# EAGLE schematic M847 (EAGLE 6.6.0)

## Sheet 1 of 3
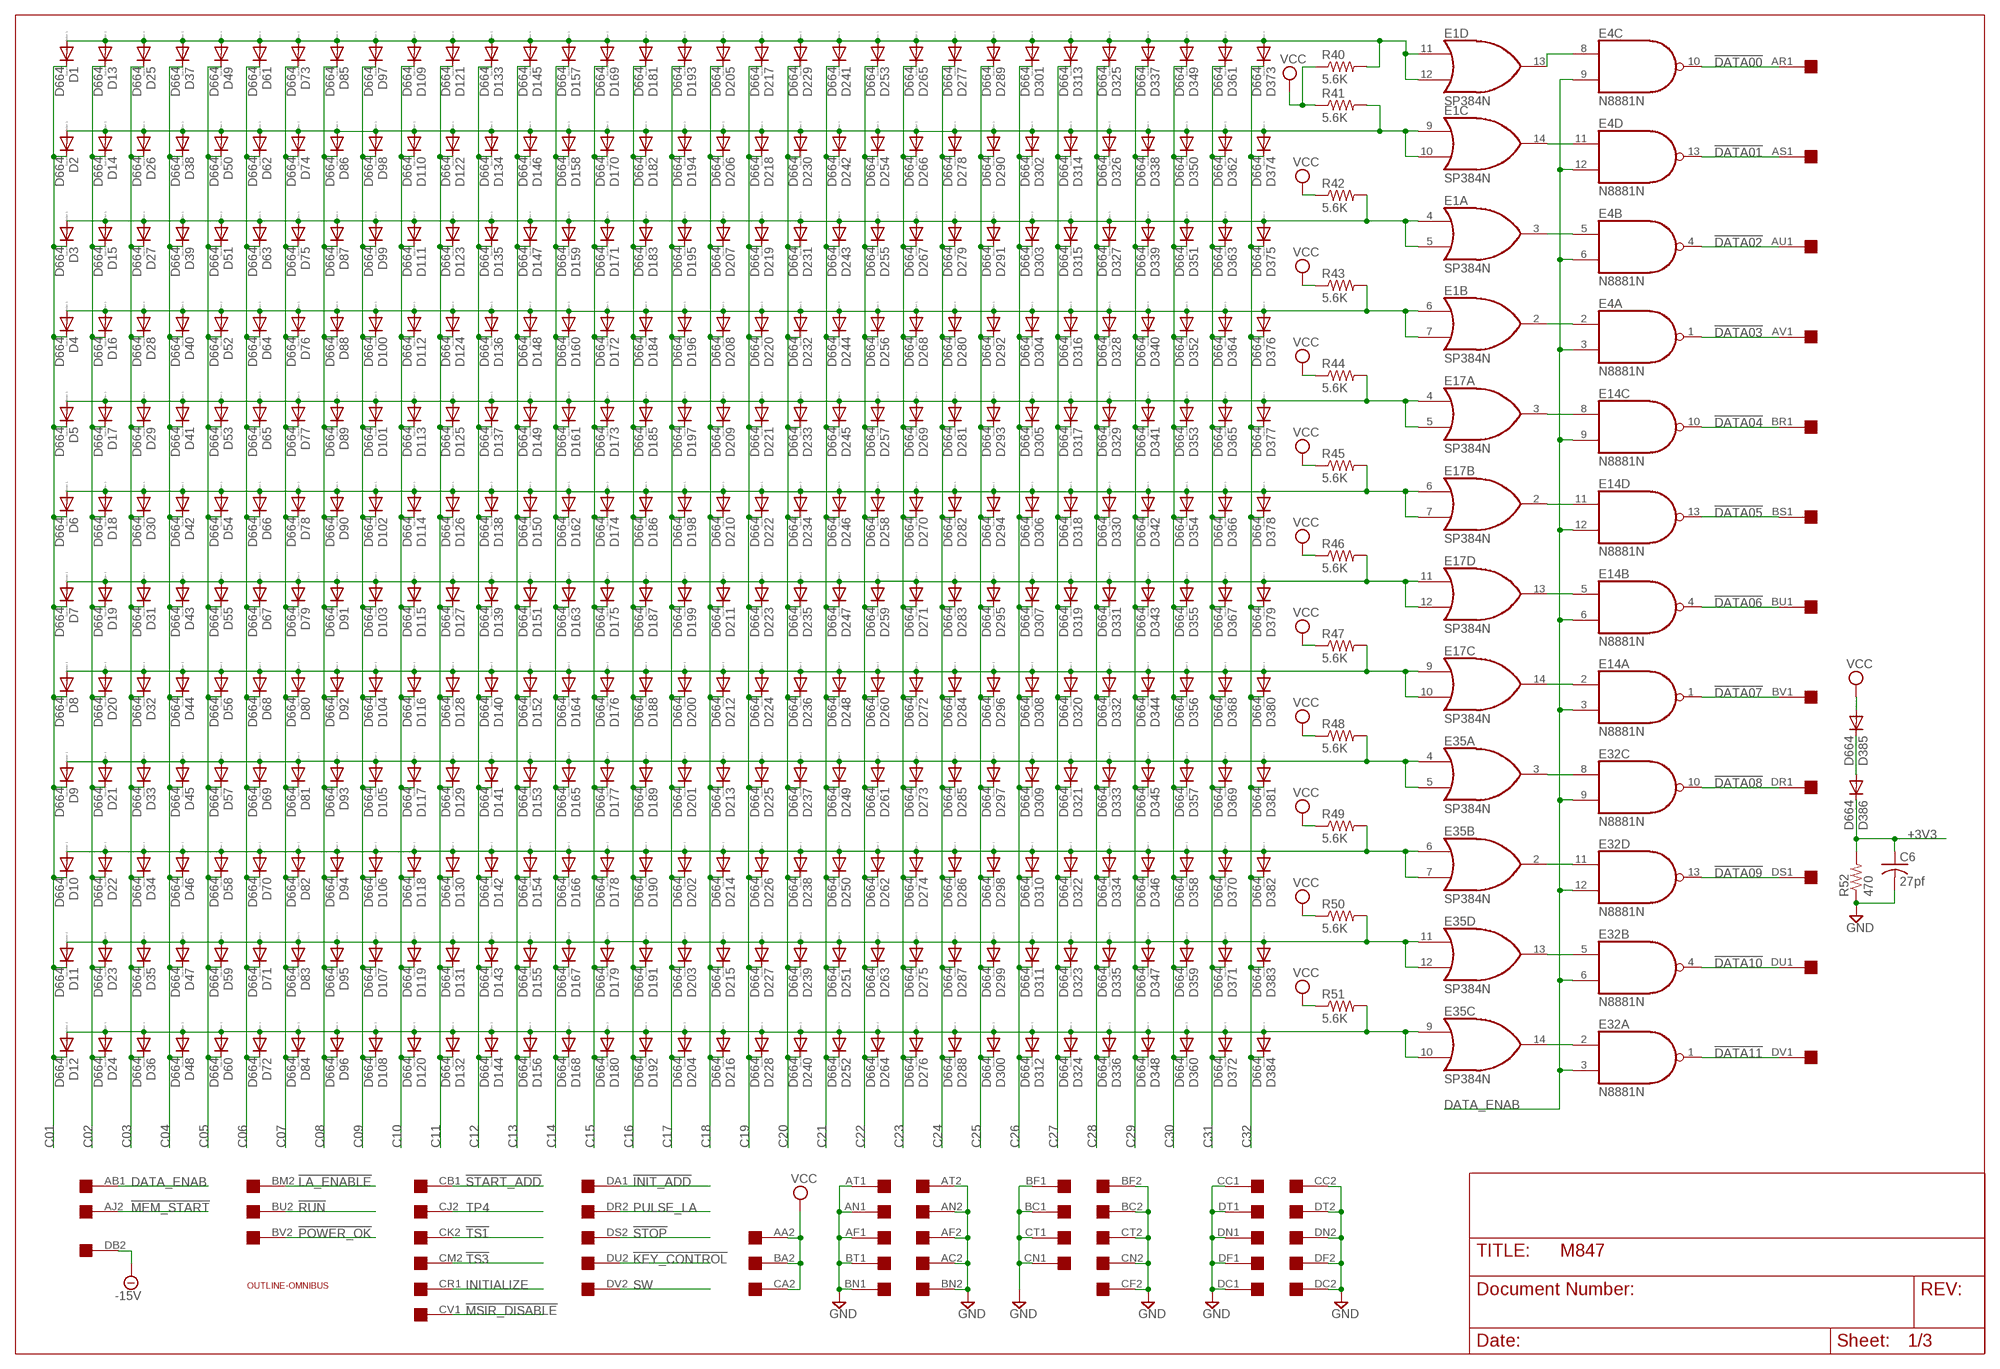
[diagram p0: schematic, sheet 1]

### Parts
C6  27pf  C-US050-025X075  [C050-025X075]
D1  D664  1N4148DO35-10  [DO35-10]
D2  D664  1N4148DO35-10  [DO35-10]
D3  D664  1N4148DO35-10  [DO35-10]
D4  D664  1N4148DO35-10  [DO35-10]
D5  D664  1N4148DO35-10  [DO35-10]
D6  D664  1N4148DO35-10  [DO35-10]
D7  D664  1N4148DO35-10  [DO35-10]
D8  D664  1N4148DO35-10  [DO35-10]
D9  D664  1N4148DO35-10  [DO35-10]
D10  D664  1N4148DO35-10  [DO35-10]
D11  D664  1N4148DO35-10  [DO35-10]
D12  D664  1N4148DO35-10  [DO35-10]
D13  D664  1N4148DO35-10  [DO35-10]
D14  D664  1N4148DO35-10  [DO35-10]
D15  D664  1N4148DO35-10  [DO35-10]
D16  D664  1N4148DO35-10  [DO35-10]
D17  D664  1N4148DO35-10  [DO35-10]
D18  D664  1N4148DO35-10  [DO35-10]
D19  D664  1N4148DO35-10  [DO35-10]
D20  D664  1N4148DO35-10  [DO35-10]
D21  D664  1N4148DO35-10  [DO35-10]
D22  D664  1N4148DO35-10  [DO35-10]
D23  D664  1N4148DO35-10  [DO35-10]
D24  D664  1N4148DO35-10  [DO35-10]
D25  D664  1N4148DO35-10  [DO35-10]
D26  D664  1N4148DO35-10  [DO35-10]
D27  D664  1N4148DO35-10  [DO35-10]
D28  D664  1N4148DO35-10  [DO35-10]
D29  D664  1N4148DO35-10  [DO35-10]
D30  D664  1N4148DO35-10  [DO35-10]
D31  D664  1N4148DO35-10  [DO35-10]
D32  D664  1N4148DO35-10  [DO35-10]
D33  D664  1N4148DO35-10  [DO35-10]
D34  D664  1N4148DO35-10  [DO35-10]
D35  D664  1N4148DO35-10  [DO35-10]
D36  D664  1N4148DO35-10  [DO35-10]
D37  D664  1N4148DO35-10  [DO35-10]
D38  D664  1N4148DO35-10  [DO35-10]
D39  D664  1N4148DO35-10  [DO35-10]
D40  D664  1N4148DO35-10  [DO35-10]
D41  D664  1N4148DO35-10  [DO35-10]
D42  D664  1N4148DO35-10  [DO35-10]
D43  D664  1N4148DO35-10  [DO35-10]
D44  D664  1N4148DO35-10  [DO35-10]
D45  D664  1N4148DO35-10  [DO35-10]
D46  D664  1N4148DO35-10  [DO35-10]
D47  D664  1N4148DO35-10  [DO35-10]
D48  D664  1N4148DO35-10  [DO35-10]
D49  D664  1N4148DO35-10  [DO35-10]
D50  D664  1N4148DO35-10  [DO35-10]
D51  D664  1N4148DO35-10  [DO35-10]
D52  D664  1N4148DO35-10  [DO35-10]
D53  D664  1N4148DO35-10  [DO35-10]
D54  D664  1N4148DO35-10  [DO35-10]
D55  D664  1N4148DO35-10  [DO35-10]
D56  D664  1N4148DO35-10  [DO35-10]
D57  D664  1N4148DO35-10  [DO35-10]
D58  D664  1N4148DO35-10  [DO35-10]
D59  D664  1N4148DO35-10  [DO35-10]
D60  D664  1N4148DO35-10  [DO35-10]
D61  D664  1N4148DO35-10  [DO35-10]
D62  D664  1N4148DO35-10  [DO35-10]
D63  D664  1N4148DO35-10  [DO35-10]
D64  D664  1N4148DO35-10  [DO35-10]
D65  D664  1N4148DO35-10  [DO35-10]
D66  D664  1N4148DO35-10  [DO35-10]
D67  D664  1N4148DO35-10  [DO35-10]
D68  D664  1N4148DO35-10  [DO35-10]
D69  D664  1N4148DO35-10  [DO35-10]
D70  D664  1N4148DO35-10  [DO35-10]
D71  D664  1N4148DO35-10  [DO35-10]
D72  D664  1N4148DO35-10  [DO35-10]
D73  D664  1N4148DO35-10  [DO35-10]
D74  D664  1N4148DO35-10  [DO35-10]
D75  D664  1N4148DO35-10  [DO35-10]
D76  D664  1N4148DO35-10  [DO35-10]
D77  D664  1N4148DO35-10  [DO35-10]
D78  D664  1N4148DO35-10  [DO35-10]
D79  D664  1N4148DO35-10  [DO35-10]
D80  D664  1N4148DO35-10  [DO35-10]
D81  D664  1N4148DO35-10  [DO35-10]
D82  D664  1N4148DO35-10  [DO35-10]
D83  D664  1N4148DO35-10  [DO35-10]
D84  D664  1N4148DO35-10  [DO35-10]
D85  D664  1N4148DO35-10  [DO35-10]
D86  D664  1N4148DO35-10  [DO35-10]
D87  D664  1N4148DO35-10  [DO35-10]
D88  D664  1N4148DO35-10  [DO35-10]
D89  D664  1N4148DO35-10  [DO35-10]
D90  D664  1N4148DO35-10  [DO35-10]
D91  D664  1N4148DO35-10  [DO35-10]
D92  D664  1N4148DO35-10  [DO35-10]
D93  D664  1N4148DO35-10  [DO35-10]
D94  D664  1N4148DO35-10  [DO35-10]
D95  D664  1N4148DO35-10  [DO35-10]
D96  D664  1N4148DO35-10  [DO35-10]
D97  D664  1N4148DO35-10  [DO35-10]
D98  D664  1N4148DO35-10  [DO35-10]
D99  D664  1N4148DO35-10  [DO35-10]
D100  D664  1N4148DO35-10  [DO35-10]
D101  D664  1N4148DO35-10  [DO35-10]
D102  D664  1N4148DO35-10  [DO35-10]
D103  D664  1N4148DO35-10  [DO35-10]
D104  D664  1N4148DO35-10  [DO35-10]
D105  D664  1N4148DO35-10  [DO35-10]
D106  D664  1N4148DO35-10  [DO35-10]
D107  D664  1N4148DO35-10  [DO35-10]
D108  D664  1N4148DO35-10  [DO35-10]
D109  D664  1N4148DO35-10  [DO35-10]
D110  D664  1N4148DO35-10  [DO35-10]
D111  D664  1N4148DO35-10  [DO35-10]
D112  D664  1N4148DO35-10  [DO35-10]
D113  D664  1N4148DO35-10  [DO35-10]
D114  D664  1N4148DO35-10  [DO35-10]
D115  D664  1N4148DO35-10  [DO35-10]
D116  D664  1N4148DO35-10  [DO35-10]
D117  D664  1N4148DO35-10  [DO35-10]
D118  D664  1N4148DO35-10  [DO35-10]
D119  D664  1N4148DO35-10  [DO35-10]
D120  D664  1N4148DO35-10  [DO35-10]
D121  D664  1N4148DO35-10  [DO35-10]
D122  D664  1N4148DO35-10  [DO35-10]
D123  D664  1N4148DO35-10  [DO35-10]
D124  D664  1N4148DO35-10  [DO35-10]
D125  D664  1N4148DO35-10  [DO35-10]
D126  D664  1N4148DO35-10  [DO35-10]
D127  D664  1N4148DO35-10  [DO35-10]
D128  D664  1N4148DO35-10  [DO35-10]
D129  D664  1N4148DO35-10  [DO35-10]
D130  D664  1N4148DO35-10  [DO35-10]
D131  D664  1N4148DO35-10  [DO35-10]
D132  D664  1N4148DO35-10  [DO35-10]
D133  D664  1N4148DO35-10  [DO35-10]
D134  D664  1N4148DO35-10  [DO35-10]
D135  D664  1N4148DO35-10  [DO35-10]
D136  D664  1N4148DO35-10  [DO35-10]
D137  D664  1N4148DO35-10  [DO35-10]
D138  D664  1N4148DO35-10  [DO35-10]
D139  D664  1N4148DO35-10  [DO35-10]
D140  D664  1N4148DO35-10  [DO35-10]
D141  D664  1N4148DO35-10  [DO35-10]
D142  D664  1N4148DO35-10  [DO35-10]
D143  D664  1N4148DO35-10  [DO35-10]
D144  D664  1N4148DO35-10  [DO35-10]
D145  D664  1N4148DO35-10  [DO35-10]
D146  D664  1N4148DO35-10  [DO35-10]
D147  D664  1N4148DO35-10  [DO35-10]
D148  D664  1N4148DO35-10  [DO35-10]
D149  D664  1N4148DO35-10  [DO35-10]
D150  D664  1N4148DO35-10  [DO35-10]
D151  D664  1N4148DO35-10  [DO35-10]
D152  D664  1N4148DO35-10  [DO35-10]
D153  D664  1N4148DO35-10  [DO35-10]
D154  D664  1N4148DO35-10  [DO35-10]
D155  D664  1N4148DO35-10  [DO35-10]
D156  D664  1N4148DO35-10  [DO35-10]
D157  D664  1N4148DO35-10  [DO35-10]
D158  D664  1N4148DO35-10  [DO35-10]
D159  D664  1N4148DO35-10  [DO35-10]
D160  D664  1N4148DO35-10  [DO35-10]
D161  D664  1N4148DO35-10  [DO35-10]
D162  D664  1N4148DO35-10  [DO35-10]
D163  D664  1N4148DO35-10  [DO35-10]
D164  D664  1N4148DO35-10  [DO35-10]
D165  D664  1N4148DO35-10  [DO35-10]
D166  D664  1N4148DO35-10  [DO35-10]
D167  D664  1N4148DO35-10  [DO35-10]
D168  D664  1N4148DO35-10  [DO35-10]
D169  D664  1N4148DO35-10  [DO35-10]
D170  D664  1N4148DO35-10  [DO35-10]
D171  D664  1N4148DO35-10  [DO35-10]
D172  D664  1N4148DO35-10  [DO35-10]
D173  D664  1N4148DO35-10  [DO35-10]
D174  D664  1N4148DO35-10  [DO35-10]
D175  D664  1N4148DO35-10  [DO35-10]
D176  D664  1N4148DO35-10  [DO35-10]
D177  D664  1N4148DO35-10  [DO35-10]
D178  D664  1N4148DO35-10  [DO35-10]
D179  D664  1N4148DO35-10  [DO35-10]
D180  D664  1N4148DO35-10  [DO35-10]
D181  D664  1N4148DO35-10  [DO35-10]
D182  D664  1N4148DO35-10  [DO35-10]
D183  D664  1N4148DO35-10  [DO35-10]
D184  D664  1N4148DO35-10  [DO35-10]
D185  D664  1N4148DO35-10  [DO35-10]
D186  D664  1N4148DO35-10  [DO35-10]
D187  D664  1N4148DO35-10  [DO35-10]
D188  D664  1N4148DO35-10  [DO35-10]
D189  D664  1N4148DO35-10  [DO35-10]
D190  D664  1N4148DO35-10  [DO35-10]
D191  D664  1N4148DO35-10  [DO35-10]
D192  D664  1N4148DO35-10  [DO35-10]
D193  D664  1N4148DO35-10  [DO35-10]
D194  D664  1N4148DO35-10  [DO35-10]
D195  D664  1N4148DO35-10  [DO35-10]
D196  D664  1N4148DO35-10  [DO35-10]
D197  D664  1N4148DO35-10  [DO35-10]
D198  D664  1N4148DO35-10  [DO35-10]
D199  D664  1N4148DO35-10  [DO35-10]
D200  D664  1N4148DO35-10  [DO35-10]
D201  D664  1N4148DO35-10  [DO35-10]
D202  D664  1N4148DO35-10  [DO35-10]
D203  D664  1N4148DO35-10  [DO35-10]
D204  D664  1N4148DO35-10  [DO35-10]
D205  D664  1N4148DO35-10  [DO35-10]
D206  D664  1N4148DO35-10  [DO35-10]
D207  D664  1N4148DO35-10  [DO35-10]
D208  D664  1N4148DO35-10  [DO35-10]
D209  D664  1N4148DO35-10  [DO35-10]
D210  D664  1N4148DO35-10  [DO35-10]
D211  D664  1N4148DO35-10  [DO35-10]
D212  D664  1N4148DO35-10  [DO35-10]
D213  D664  1N4148DO35-10  [DO35-10]
D214  D664  1N4148DO35-10  [DO35-10]
D215  D664  1N4148DO35-10  [DO35-10]
D216  D664  1N4148DO35-10  [DO35-10]
D217  D664  1N4148DO35-10  [DO35-10]
D218  D664  1N4148DO35-10  [DO35-10]
D219  D664  1N4148DO35-10  [DO35-10]
D220  D664  1N4148DO35-10  [DO35-10]
D221  D664  1N4148DO35-10  [DO35-10]
D222  D664  1N4148DO35-10  [DO35-10]
D223  D664  1N4148DO35-10  [DO35-10]
D224  D664  1N4148DO35-10  [DO35-10]
D225  D664  1N4148DO35-10  [DO35-10]
D226  D664  1N4148DO35-10  [DO35-10]
D227  D664  1N4148DO35-10  [DO35-10]
D228  D664  1N4148DO35-10  [DO35-10]
D229  D664  1N4148DO35-10  [DO35-10]
D230  D664  1N4148DO35-10  [DO35-10]
D231  D664  1N4148DO35-10  [DO35-10]
D232  D664  1N4148DO35-10  [DO35-10]
D233  D664  1N4148DO35-10  [DO35-10]
D234  D664  1N4148DO35-10  [DO35-10]
D235  D664  1N4148DO35-10  [DO35-10]
D236  D664  1N4148DO35-10  [DO35-10]
D237  D664  1N4148DO35-10  [DO35-10]
D238  D664  1N4148DO35-10  [DO35-10]
D239  D664  1N4148DO35-10  [DO35-10]
D240  D664  1N4148DO35-10  [DO35-10]
D241  D664  1N4148DO35-10  [DO35-10]
D242  D664  1N4148DO35-10  [DO35-10]
D243  D664  1N4148DO35-10  [DO35-10]
D244  D664  1N4148DO35-10  [DO35-10]
D245  D664  1N4148DO35-10  [DO35-10]
D246  D664  1N4148DO35-10  [DO35-10]
D247  D664  1N4148DO35-10  [DO35-10]
D248  D664  1N4148DO35-10  [DO35-10]
D249  D664  1N4148DO35-10  [DO35-10]
D250  D664  1N4148DO35-10  [DO35-10]
D251  D664  1N4148DO35-10  [DO35-10]
D252  D664  1N4148DO35-10  [DO35-10]
D253  D664  1N4148DO35-10  [DO35-10]
D254  D664  1N4148DO35-10  [DO35-10]
D255  D664  1N4148DO35-10  [DO35-10]
D256  D664  1N4148DO35-10  [DO35-10]
D257  D664  1N4148DO35-10  [DO35-10]
D258  D664  1N4148DO35-10  [DO35-10]
D259  D664  1N4148DO35-10  [DO35-10]
D260  D664  1N4148DO35-10  [DO35-10]
D261  D664  1N4148DO35-10  [DO35-10]
D262  D664  1N4148DO35-10  [DO35-10]
D263  D664  1N4148DO35-10  [DO35-10]
D264  D664  1N4148DO35-10  [DO35-10]
D265  D664  1N4148DO35-10  [DO35-10]
D266  D664  1N4148DO35-10  [DO35-10]
D267  D664  1N4148DO35-10  [DO35-10]
D268  D664  1N4148DO35-10  [DO35-10]
D269  D664  1N4148DO35-10  [DO35-10]
D270  D664  1N4148DO35-10  [DO35-10]
D271  D664  1N4148DO35-10  [DO35-10]
D272  D664  1N4148DO35-10  [DO35-10]
D273  D664  1N4148DO35-10  [DO35-10]
D274  D664  1N4148DO35-10  [DO35-10]
D275  D664  1N4148DO35-10  [DO35-10]
D276  D664  1N4148DO35-10  [DO35-10]
D277  D664  1N4148DO35-10  [DO35-10]
D278  D664  1N4148DO35-10  [DO35-10]
D279  D664  1N4148DO35-10  [DO35-10]
D280  D664  1N4148DO35-10  [DO35-10]
D281  D664  1N4148DO35-10  [DO35-10]
D282  D664  1N4148DO35-10  [DO35-10]
D283  D664  1N4148DO35-10  [DO35-10]
D284  D664  1N4148DO35-10  [DO35-10]
D285  D664  1N4148DO35-10  [DO35-10]
D286  D664  1N4148DO35-10  [DO35-10]
D287  D664  1N4148DO35-10  [DO35-10]
D288  D664  1N4148DO35-10  [DO35-10]
D289  D664  1N4148DO35-10  [DO35-10]
D290  D664  1N4148DO35-10  [DO35-10]
D291  D664  1N4148DO35-10  [DO35-10]
D292  D664  1N4148DO35-10  [DO35-10]
D293  D664  1N4148DO35-10  [DO35-10]
D294  D664  1N4148DO35-10  [DO35-10]
D295  D664  1N4148DO35-10  [DO35-10]
D296  D664  1N4148DO35-10  [DO35-10]
D297  D664  1N4148DO35-10  [DO35-10]
D298  D664  1N4148DO35-10  [DO35-10]
D299  D664  1N4148DO35-10  [DO35-10]
D300  D664  1N4148DO35-10  [DO35-10]
D301  D664  1N4148DO35-10  [DO35-10]
D302  D664  1N4148DO35-10  [DO35-10]
D303  D664  1N4148DO35-10  [DO35-10]
D304  D664  1N4148DO35-10  [DO35-10]
D305  D664  1N4148DO35-10  [DO35-10]
D306  D664  1N4148DO35-10  [DO35-10]
D307  D664  1N4148DO35-10  [DO35-10]
D308  D664  1N4148DO35-10  [DO35-10]
D309  D664  1N4148DO35-10  [DO35-10]
D310  D664  1N4148DO35-10  [DO35-10]
D311  D664  1N4148DO35-10  [DO35-10]
D312  D664  1N4148DO35-10  [DO35-10]
D313  D664  1N4148DO35-10  [DO35-10]
D314  D664  1N4148DO35-10  [DO35-10]
D315  D664  1N4148DO35-10  [DO35-10]
D316  D664  1N4148DO35-10  [DO35-10]
D317  D664  1N4148DO35-10  [DO35-10]
D318  D664  1N4148DO35-10  [DO35-10]
D319  D664  1N4148DO35-10  [DO35-10]
D320  D664  1N4148DO35-10  [DO35-10]
D321  D664  1N4148DO35-10  [DO35-10]
D322  D664  1N4148DO35-10  [DO35-10]
D323  D664  1N4148DO35-10  [DO35-10]
D324  D664  1N4148DO35-10  [DO35-10]
D325  D664  1N4148DO35-10  [DO35-10]
D326  D664  1N4148DO35-10  [DO35-10]
D327  D664  1N4148DO35-10  [DO35-10]
D328  D664  1N4148DO35-10  [DO35-10]
D329  D664  1N4148DO35-10  [DO35-10]
D330  D664  1N4148DO35-10  [DO35-10]
D331  D664  1N4148DO35-10  [DO35-10]
D332  D664  1N4148DO35-10  [DO35-10]
D333  D664  1N4148DO35-10  [DO35-10]
D334  D664  1N4148DO35-10  [DO35-10]
D335  D664  1N4148DO35-10  [DO35-10]
D336  D664  1N4148DO35-10  [DO35-10]
D337  D664  1N4148DO35-10  [DO35-10]
D338  D664  1N4148DO35-10  [DO35-10]
D339  D664  1N4148DO35-10  [DO35-10]
D340  D664  1N4148DO35-10  [DO35-10]
D341  D664  1N4148DO35-10  [DO35-10]
D342  D664  1N4148DO35-10  [DO35-10]
D343  D664  1N4148DO35-10  [DO35-10]
D344  D664  1N4148DO35-10  [DO35-10]
D345  D664  1N4148DO35-10  [DO35-10]
D346  D664  1N4148DO35-10  [DO35-10]
D347  D664  1N4148DO35-10  [DO35-10]
D348  D664  1N4148DO35-10  [DO35-10]
D349  D664  1N4148DO35-10  [DO35-10]
D350  D664  1N4148DO35-10  [DO35-10]
D351  D664  1N4148DO35-10  [DO35-10]
D352  D664  1N4148DO35-10  [DO35-10]
D353  D664  1N4148DO35-10  [DO35-10]
D354  D664  1N4148DO35-10  [DO35-10]
D355  D664  1N4148DO35-10  [DO35-10]
D356  D664  1N4148DO35-10  [DO35-10]
D357  D664  1N4148DO35-10  [DO35-10]
D358  D664  1N4148DO35-10  [DO35-10]
D359  D664  1N4148DO35-10  [DO35-10]
D360  D664  1N4148DO35-10  [DO35-10]
D361  D664  1N4148DO35-10  [DO35-10]
D362  D664  1N4148DO35-10  [DO35-10]
D363  D664  1N4148DO35-10  [DO35-10]
D364  D664  1N4148DO35-10  [DO35-10]
D365  D664  1N4148DO35-10  [DO35-10]
D366  D664  1N4148DO35-10  [DO35-10]
D367  D664  1N4148DO35-10  [DO35-10]
D368  D664  1N4148DO35-10  [DO35-10]
D369  D664  1N4148DO35-10  [DO35-10]
D370  D664  1N4148DO35-10  [DO35-10]
D371  D664  1N4148DO35-10  [DO35-10]
D372  D664  1N4148DO35-10  [DO35-10]
D373  D664  1N4148DO35-10  [DO35-10]
D374  D664  1N4148DO35-10  [DO35-10]
D375  D664  1N4148DO35-10  [DO35-10]
D376  D664  1N4148DO35-10  [DO35-10]
D377  D664  1N4148DO35-10  [DO35-10]
D378  D664  1N4148DO35-10  [DO35-10]
D379  D664  1N4148DO35-10  [DO35-10]
D380  D664  1N4148DO35-10  [DO35-10]
D381  D664  1N4148DO35-10  [DO35-10]
D382  D664  1N4148DO35-10  [DO35-10]
D383  D664  1N4148DO35-10  [DO35-10]
D384  D664  1N4148DO35-10  [DO35-10]
D385  D664  1N4148DO35-10  [DO35-10]
D386  D664  1N4148DO35-10  [DO35-10]
E1  SP384N  [DIL14]
E4  N8881N  [DIL14]
E14  N8881N  [DIL14]
E17  SP384N  [DIL14]
E32  N8881N  [DIL14]
E35  SP384N  [DIL14]
R40  5.6K  R-US_0207/10  [0207/10]
R41  5.6K  R-US_0207/10  [0207/10]
R42  5.6K  R-US_0207/10  [0207/10]
R43  5.6K  R-US_0207/10  [0207/10]
R44  5.6K  R-US_0207/10  [0207/10]
R45  5.6K  R-US_0207/10  [0207/10]
R46  5.6K  R-US_0207/10  [0207/10]
R47  5.6K  R-US_0207/10  [0207/10]
R48  5.6K  R-US_0207/10  [0207/10]
R49  5.6K  R-US_0207/10  [0207/10]
R50  5.6K  R-US_0207/10  [0207/10]
R51  5.6K  R-US_0207/10  [0207/10]
R52  470  R-US_0207/10  [0207/10]
U$1  OUTLINE-OMNIBUS  [OMNIBUS]
U$2  QUAD  [EDGE-CON8]

### Nets
!DATA00: E4.10(C:O) U$2.AR1 ; also sheet 2
!DATA01: E4.13(D:O) U$2.AS1 ; also sheet 2
!DATA02: E4.4(B:O) U$2.AU1 ; also sheet 2
!DATA03: E4.1(A:O) U$2.AV1 ; also sheet 2
!DATA04: E14.10(C:O) U$2.BR1 ; also sheet 2
!DATA05: E14.13(D:O) U$2.BS1 ; also sheet 2
!DATA06: E14.4(B:O) U$2.BU1 ; also sheet 2
!DATA07: E14.1(A:O) U$2.BV1 ; also sheet 2
!DATA08: E32.10(C:O) U$2.DR1 ; also sheet 2
!DATA09: E32.13(D:O) U$2.DS1 ; also sheet 2
!DATA10: E32.4(B:O) U$2.DU1 ; also sheet 2
!DATA11: E32.1(A:O) U$2.DV1 ; also sheet 2
!INIT_ADD: U$2.DA1 ; also sheet 2,3
!KEY_CONTROL: U$2.DU2 ; also sheet 2
!LA_ENABLE: U$2.BM2 ; also sheet 2
!MEM_START: U$2.AJ2 ; also sheet 2
!MSIR_DISABLE: U$2.CV1 ; also sheet 3
!POWER_OK: U$2.BV2 ; also sheet 3
!RUN: U$2.BU2 ; also sheet 3
!START_ADD: U$2.CB1 ; also sheet 2,3
!STOP: U$2.DS2 ; also sheet 3
!TS1: U$2.CK2 ; also sheet 2
!TS3: U$2.CM2 ; also sheet 2
+3V3 [supply]: C6.1 D386.C R52.2 ; also sheet 2,3
-15V [supply]: U$2.DB2 ; also sheet 2,3
C01: D1.C D2.C D3.C D4.C D5.C D6.C D7.C D8.C D9.C D10.C D11.C D12.C ; also sheet 2
C02: D13.C D14.C D15.C D16.C D17.C D18.C D19.C D20.C D21.C D22.C D23.C D24.C ; also sheet 2
C03: D25.C D26.C D27.C D28.C D29.C D30.C D31.C D32.C D33.C D34.C D35.C D36.C ; also sheet 2
C04: D37.C D38.C D39.C D40.C D41.C D42.C D43.C D44.C D45.C D46.C D47.C D48.C ; also sheet 2
C05: D49.C D50.C D51.C D52.C D53.C D54.C D55.C D56.C D57.C D58.C D59.C D60.C ; also sheet 2
C06: D61.C D62.C D63.C D64.C D65.C D66.C D67.C D68.C D69.C D70.C D71.C D72.C ; also sheet 2
C07: D73.C D74.C D75.C D76.C D77.C D78.C D79.C D80.C D81.C D82.C D83.C D84.C ; also sheet 2
C08: D85.C D86.C D87.C D88.C D89.C D90.C D91.C D92.C D93.C D94.C D95.C D96.C ; also sheet 2
C09: D97.C D98.C D99.C D100.C D101.C D102.C D103.C D104.C D105.C D106.C D107.C D108.C ; also sheet 2
C10: D109.C D110.C D111.C D112.C D113.C D114.C D115.C D116.C D117.C D118.C D119.C D120.C ; also sheet 2
C11: D121.C D122.C D123.C D124.C D125.C D126.C D127.C D128.C D129.C D130.C D131.C D132.C ; also sheet 2
C12: D133.C D134.C D135.C D136.C D137.C D138.C D139.C D140.C D141.C D142.C D143.C D144.C ; also sheet 2
C13: D145.C D146.C D147.C D148.C D149.C D150.C D151.C D152.C D153.C D154.C D155.C D156.C ; also sheet 2
C14: D157.C D158.C D159.C D160.C D161.C D162.C D163.C D164.C D165.C D166.C D167.C D168.C ; also sheet 2
C15: D169.C D170.C D171.C D172.C D173.C D174.C D175.C D176.C D177.C D178.C D179.C D180.C ; also sheet 2
C16: D181.C D182.C D183.C D184.C D185.C D186.C D187.C D188.C D189.C D190.C D191.C D192.C ; also sheet 2
C17: D193.C D194.C D195.C D196.C D197.C D198.C D199.C D200.C D201.C D202.C D203.C D204.C ; also sheet 2
C18: D205.C D206.C D207.C D208.C D209.C D210.C D211.C D212.C D213.C D214.C D215.C D216.C ; also sheet 2
C19: D217.C D218.C D219.C D220.C D221.C D222.C D223.C D224.C D225.C D226.C D227.C D228.C ; also sheet 2
C20: D229.C D230.C D231.C D232.C D233.C D234.C D235.C D236.C D237.C D238.C D239.C D240.C ; also sheet 2
C21: D241.C D242.C D243.C D244.C D245.C D246.C D247.C D248.C D249.C D250.C D251.C D252.C ; also sheet 2
C22: D253.C D254.C D255.C D256.C D257.C D258.C D259.C D260.C D261.C D262.C D263.C D264.C ; also sheet 2
C23: D265.C D266.C D267.C D268.C D269.C D270.C D271.C D272.C D273.C D274.C D275.C D276.C ; also sheet 2
C24: D277.C D278.C D279.C D280.C D281.C D282.C D283.C D284.C D285.C D286.C D287.C D288.C ; also sheet 2
C25: D289.C D290.C D291.C D292.C D293.C D294.C D295.C D296.C D297.C D298.C D299.C D300.C ; also sheet 2
C26: D301.C D302.C D303.C D304.C D305.C D306.C D307.C D308.C D309.C D310.C D311.C D312.C ; also sheet 2
C27: D313.C D314.C D315.C D316.C D317.C D318.C D319.C D320.C D321.C D322.C D323.C D324.C ; also sheet 2
C28: D325.C D326.C D327.C D328.C D329.C D330.C D331.C D332.C D333.C D334.C D335.C D336.C ; also sheet 2
C29: D337.C D338.C D339.C D340.C D341.C D342.C D343.C D344.C D345.C D346.C D347.C D348.C ; also sheet 2
C30: D349.C D350.C D351.C D352.C D353.C D354.C D355.C D356.C D357.C D358.C D359.C D360.C ; also sheet 2
C31: D361.C D362.C D363.C D364.C D365.C D366.C D367.C D368.C D369.C D370.C D371.C D372.C ; also sheet 2
C32: D373.C D374.C D375.C D376.C D377.C D378.C D379.C D380.C D381.C D382.C D383.C D384.C ; also sheet 2
DATA_ENAB: E4.3(A:I1) E4.6(B:I1) E4.9(C:I1) E4.12(D:I1) E14.3(A:I1) E14.6(B:I1) E14.9(C:I1) E14.12(D:I1) E32.3(A:I1) E32.6(B:I1) E32.9(C:I1) E32.12(D:I1) U$2.AB1 ; also sheet 2,3
GND [supply]: C6.2 R52.1 U$2.AC2 U$2.AF1 U$2.AF2 U$2.AN1 U$2.AN2 U$2.AT1 U$2.AT2 U$2.BC1 U$2.BC2 U$2.BF1 U$2.BF2 U$2.BN1 U$2.BN2 U$2.BT1 U$2.CC1 U$2.CC2 U$2.CF2 U$2.CN1 U$2.CN2 U$2.CT1 U$2.CT2 U$2.DC1 U$2.DC2 U$2.DF1 U$2.DF2 U$2.DN1 U$2.DN2 U$2.DT1 U$2.DT2 ; also sheet 2,3
INITIALIZE: U$2.CR1 ; also sheet 3
N$33: D1.A D13.A D25.A D37.A D49.A D61.A D73.A D85.A D97.A D109.A D121.A D133.A D145.A D157.A D169.A D181.A D193.A D205.A D217.A D229.A D241.A D253.A D265.A D277.A D289.A D301.A D313.A D325.A D337.A D349.A D361.A D373.A E1.11(D:I0) E1.12(D:I1) R40.2
N$34: D12.A D24.A D36.A D48.A D60.A D72.A D84.A D96.A D108.A D120.A D132.A D144.A D156.A D168.A D180.A D192.A D204.A D216.A D228.A D240.A D252.A D264.A D276.A D288.A D300.A D312.A D324.A D336.A D348.A D360.A D372.A D384.A E35.9(C:I0) E35.10(C:I1) R51.2
N$35: D11.A D23.A D35.A D47.A D59.A D71.A D83.A D95.A D107.A D119.A D131.A D143.A D155.A D167.A D179.A D191.A D203.A D215.A D227.A D239.A D251.A D263.A D275.A D287.A D299.A D311.A D323.A D335.A D347.A D359.A D371.A D383.A E35.11(D:I0) E35.12(D:I1) R50.2
N$36: D10.A D22.A D34.A D46.A D58.A D70.A D82.A D94.A D106.A D118.A D130.A D142.A D154.A D166.A D178.A D190.A D202.A D214.A D226.A D238.A D250.A D262.A D274.A D286.A D298.A D310.A D322.A D334.A D346.A D358.A D370.A D382.A E35.6(B:I0) E35.7(B:I1) R49.2
N$37: D8.A D20.A D32.A D44.A D56.A D68.A D80.A D92.A D104.A D116.A D128.A D140.A D152.A D164.A D176.A D188.A D200.A D212.A D224.A D236.A D248.A D260.A D272.A D284.A D296.A D308.A D320.A D332.A D344.A D356.A D368.A D380.A E17.9(C:I0) E17.10(C:I1) R47.2
N$38: D7.A D19.A D31.A D43.A D55.A D67.A D79.A D91.A D103.A D115.A D127.A D139.A D151.A D163.A D175.A D187.A D199.A D211.A D223.A D235.A D247.A D259.A D271.A D283.A D295.A D307.A D319.A D331.A D343.A D355.A D367.A D379.A E17.11(D:I0) E17.12(D:I1) R46.2
N$39: D9.A D21.A D33.A D45.A D57.A D69.A D81.A D93.A D105.A D117.A D129.A D141.A D153.A D165.A D177.A D189.A D201.A D213.A D225.A D237.A D249.A D261.A D273.A D285.A D297.A D309.A D321.A D333.A D345.A D357.A D369.A D381.A E35.4(A:I0) E35.5(A:I1) R48.2
N$40: D6.A D18.A D30.A D42.A D54.A D66.A D78.A D90.A D102.A D114.A D126.A D138.A D150.A D162.A D174.A D186.A D198.A D210.A D222.A D234.A D246.A D258.A D270.A D282.A D294.A D306.A D318.A D330.A D342.A D354.A D366.A D378.A E17.6(B:I0) E17.7(B:I1) R45.2
N$41: D5.A D17.A D29.A D41.A D53.A D65.A D77.A D89.A D101.A D113.A D125.A D137.A D149.A D161.A D173.A D185.A D197.A D209.A D221.A D233.A D245.A D257.A D269.A D281.A D293.A D305.A D317.A D329.A D341.A D353.A D365.A D377.A E17.4(A:I0) E17.5(A:I1) R44.2
N$42: D4.A D16.A D28.A D40.A D52.A D64.A D76.A D88.A D100.A D112.A D124.A D136.A D148.A D160.A D172.A D184.A D196.A D208.A D220.A D232.A D244.A D256.A D268.A D280.A D292.A D304.A D316.A D328.A D340.A D352.A D364.A D376.A E1.6(B:I0) E1.7(B:I1) R43.2
N$43: D3.A D15.A D27.A D39.A D51.A D63.A D75.A D87.A D99.A D111.A D123.A D135.A D147.A D159.A D171.A D183.A D195.A D207.A D219.A D231.A D243.A D255.A D267.A D279.A D291.A D303.A D315.A D327.A D339.A D351.A D363.A D375.A E1.4(A:I0) E1.5(A:I1) R42.2
N$44: D2.A D14.A D26.A D38.A D50.A D62.A D74.A D86.A D98.A D110.A D122.A D134.A D146.A D158.A D170.A D182.A D194.A D206.A D218.A D230.A D242.A D254.A D266.A D278.A D290.A D302.A D314.A D326.A D338.A D350.A D362.A D374.A E1.9(C:I0) E1.10(C:I1) R41.2
N$45: E14.5(B:I0) E17.13(D:O)
N$46: E14.11(D:I0) E17.2(B:O)
N$47: E14.8(C:I0) E17.3(A:O)
N$48: E1.2(B:O) E4.2(A:I0)
N$49: E1.3(A:O) E4.5(B:I0)
N$50: E1.14(C:O) E4.11(D:I0)
N$51: E1.13(D:O) E4.8(C:I0)
N$52: E32.2(A:I0) E35.14(C:O)
N$53: E32.5(B:I0) E35.13(D:O)
N$54: E32.11(D:I0) E35.2(B:O)
N$55: E32.8(C:I0) E35.3(A:O)
N$56: E14.2(A:I0) E17.14(C:O)
N$142: D385.C D386.A
PULSE_LA: U$2.DR2 ; also sheet 2
SW: U$2.DV2 ; also sheet 3
TP4: U$2.CJ2 ; also sheet 3
VCC [supply]: D385.A R40.1 R41.1 R42.1 R43.1 R44.1 R45.1 R46.1 R47.1 R48.1 R49.1 R50.1 R51.1 U$2.AA2 U$2.BA2 U$2.CA2 ; also sheet 2,3
Unconnected: U$2.AA1 U$2.AB2 U$2.AC1 U$2.AD1 U$2.AD2 U$2.AE1 U$2.AE2 U$2.AH1 U$2.AH2 U$2.AJ1 U$2.AK1 U$2.AK2 U$2.AL1 U$2.AL2 U$2.AM1 U$2.AM2 U$2.AP1 U$2.AP2 U$2.AR2 U$2.AS2 U$2.AU2 U$2.AV2 U$2.BA1 U$2.BB1 U$2.BB2 U$2.BD1 U$2.BD2 U$2.BE1 U$2.BE2 U$2.BH1 U$2.BH2 U$2.BJ1 U$2.BJ2 U$2.BK1 U$2.BK2 U$2.BL1 U$2.BL2 U$2.BM1 U$2.BP1 U$2.BP2 U$2.BR2 U$2.BS2 U$2.BT2 U$2.CA1 U$2.CB2 U$2.CD1 U$2.CD2 U$2.CE1 U$2.CE2 U$2.CF1 U$2.CH1 U$2.CH2 U$2.CJ1 U$2.CK1 U$2.CL1 U$2.CL2 U$2.CM1 U$2.CP1 U$2.CP2 U$2.CR2 U$2.CS1 U$2.CS2 U$2.CU1 U$2.CU2 U$2.CV2 U$2.DA2 U$2.DB1 U$2.DD1 U$2.DD2 U$2.DE1 U$2.DE2 U$2.DH1 U$2.DH2 U$2.DJ1 U$2.DJ2 U$2.DK1 U$2.DK2 U$2.DL1 U$2.DL2 U$2.DM1 U$2.DM2 U$2.DP1 U$2.DP2

## Sheet 2 of 3
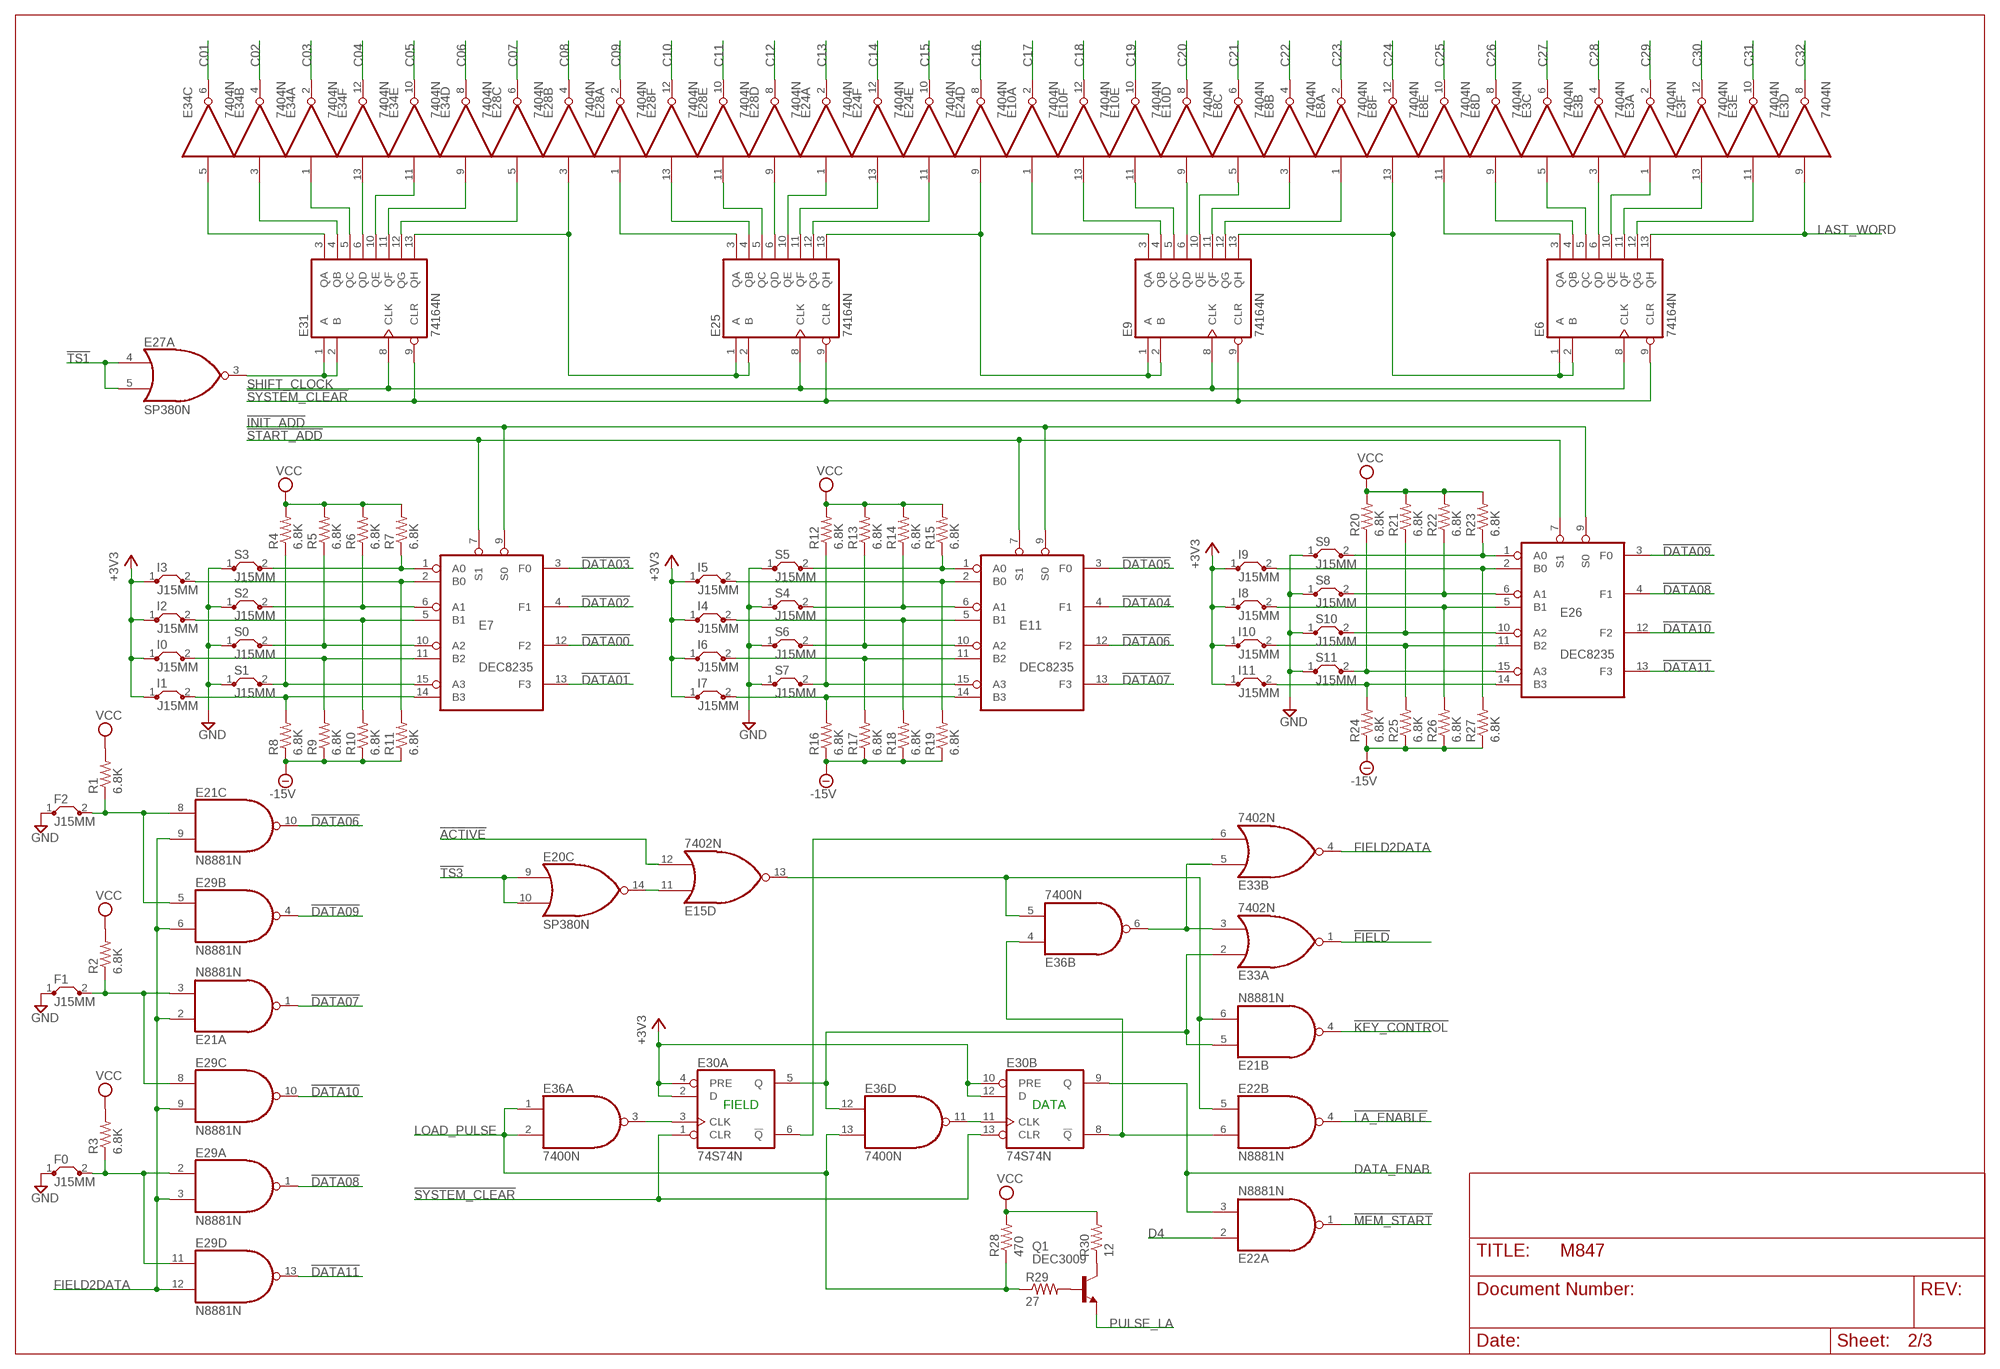
[diagram p1: schematic, sheet 2]

### Parts
E3  7404N  [DIL14]
E6  74164N  [DIL14]
E7  DEC8235  [DIL16]
E8  7404N  [DIL14]
E9  74164N  [DIL14]
E10  7404N  [DIL14]
E11  DEC8235  [DIL16]
E15  7402N  [DIL14]
E20  SP380N  [DIL14]
E21  N8881N  [DIL14]
E22  N8881N  [DIL14]
E24  7404N  [DIL14]
E25  74164N  [DIL14]
E26  DEC8235  [DIL16]
E27  SP380N  [DIL14]
E28  7404N  [DIL14]
E29  N8881N  [DIL14]
E30  74S74N  [DIL14]
E31  74164N  [DIL14]
E33  7402N  [DIL14]
E34  7404N  [DIL14]
E36  7400N  [DIL14]
F0  J15MM  [15]
F1  J15MM  [15]
F2  J15MM  [15]
I0  J15MM  [15]
I1  J15MM  [15]
I2  J15MM  [15]
I3  J15MM  [15]
I4  J15MM  [15]
I5  J15MM  [15]
I6  J15MM  [15]
I7  J15MM  [15]
I8  J15MM  [15]
I9  J15MM  [15]
I10  J15MM  [15]
I11  J15MM  [15]
Q1  DEC3009  -NPN-TO92  [TO92]
R1  6.8K  R-US_0207/10  [0207/10]
R2  6.8K  R-US_0207/10  [0207/10]
R3  6.8K  R-US_0207/10  [0207/10]
R4  6.8K  R-US_0207/10  [0207/10]
R5  6.8K  R-US_0207/10  [0207/10]
R6  6.8K  R-US_0207/10  [0207/10]
R7  6.8K  R-US_0207/10  [0207/10]
R8  6.8K  R-US_0207/10  [0207/10]
R9  6.8K  R-US_0207/10  [0207/10]
R10  6.8K  R-US_0207/10  [0207/10]
R11  6.8K  R-US_0207/10  [0207/10]
R12  6.8K  R-US_0207/10  [0207/10]
R13  6.8K  R-US_0207/10  [0207/10]
R14  6.8K  R-US_0207/10  [0207/10]
R15  6.8K  R-US_0207/10  [0207/10]
R16  6.8K  R-US_0207/10  [0207/10]
R17  6.8K  R-US_0207/10  [0207/10]
R18  6.8K  R-US_0207/10  [0207/10]
R19  6.8K  R-US_0207/10  [0207/10]
R20  6.8K  R-US_0207/10  [0207/10]
R21  6.8K  R-US_0207/10  [0207/10]
R22  6.8K  R-US_0207/10  [0207/10]
R23  6.8K  R-US_0207/10  [0207/10]
R24  6.8K  R-US_0207/10  [0207/10]
R25  6.8K  R-US_0207/10  [0207/10]
R26  6.8K  R-US_0207/10  [0207/10]
R27  6.8K  R-US_0207/10  [0207/10]
R28  470  R-US_0207/10  [0207/10]
R29  27  R-US_0207/10  [0207/10]
R30  12  R-US_0207/10  [0207/10]
S0  J15MM  [15]
S1  J15MM  [15]
S2  J15MM  [15]
S3  J15MM  [15]
S4  J15MM  [15]
S5  J15MM  [15]
S6  J15MM  [15]
S7  J15MM  [15]
S8  J15MM  [15]
S9  J15MM  [15]
S10  J15MM  [15]
S11  J15MM  [15]

### Nets
!ACTIVE: E15.12(D:I1) ; also sheet 3
!DATA00: E7.12(F2) ; also sheet 1
!DATA01: E7.13(F3) ; also sheet 1
!DATA02: E7.4(F1) ; also sheet 1
!DATA03: E7.3(F0) ; also sheet 1
!DATA04: E11.4(F1) ; also sheet 1
!DATA05: E11.3(F0) ; also sheet 1
!DATA06: E11.12(F2) E21.10(C:O) ; also sheet 1
!DATA07: E11.13(F3) E21.1(A:O) ; also sheet 1
!DATA08: E26.4(F1) E29.1(A:O) ; also sheet 1
!DATA09: E26.3(F0) E29.4(B:O) ; also sheet 1
!DATA10: E26.12(F2) E29.10(C:O) ; also sheet 1
!DATA11: E26.13(F3) E29.13(D:O) ; also sheet 1
!DATA_EN: E22.6(B:I1) E30.8(B:!Q) E36.4(B:I0)
!FIELD: E33.1(A:O) ; also sheet 3
!FIELD_EN: E30.6(A:!Q) E33.6(B:I1)
!INIT_ADD: E7.9(S0) E11.9(S0) E26.9(S0) ; also sheet 1,3
!KEY_CONTROL: E21.4(B:O) ; also sheet 1
!LA_ENABLE: E22.4(B:O) ; also sheet 1
!MEM_START: E22.1(A:O) ; also sheet 1
!START_ADD: E7.7(S1) E11.7(S1) E26.7(S1) ; also sheet 1,3
!SYSTEM_CLEAR: E6.9(CLR) E9.9(CLR) E25.9(CLR) E30.1(A:CLR) E30.13(B:CLR) E31.9(CLR) ; also sheet 3
!TS1: E27.4(A:I0) E27.5(A:I1) ; also sheet 1
!TS3: E20.9(C:I0) E20.10(C:I1) ; also sheet 1
+3V3 [supply]: E30.2(A:D) E30.4(A:PRE) E30.10(B:PRE) E30.12(B:D) I0.1 I1.1 I2.1 I3.1 I4.1 I5.1 I6.1 I7.1 I8.1 I9.1 I10.1 I11.1 ; also sheet 1,3
-15V [supply]: R8.1 R9.1 R10.1 R11.1 R16.1 R17.1 R18.1 R19.1 R24.1 R25.1 R26.1 R27.1 ; also sheet 1,3
C01: E34.6(C:O) ; also sheet 1
C02: E34.4(B:O) ; also sheet 1
C03: E34.2(A:O) ; also sheet 1
C04: E34.12(F:O) ; also sheet 1
C05: E34.10(E:O) ; also sheet 1
C06: E34.8(D:O) ; also sheet 1
C07: E28.6(C:O) ; also sheet 1
C08: E28.4(B:O) ; also sheet 1
C09: E28.2(A:O) ; also sheet 1
C10: E28.12(F:O) ; also sheet 1
C11: E28.10(E:O) ; also sheet 1
C12: E28.8(D:O) ; also sheet 1
C13: E24.2(A:O) ; also sheet 1
C14: E24.12(F:O) ; also sheet 1
C15: E24.10(E:O) ; also sheet 1
C16: E24.8(D:O) ; also sheet 1
C17: E10.2(A:O) ; also sheet 1
C18: E10.12(F:O) ; also sheet 1
C19: E10.10(E:O) ; also sheet 1
C20: E10.8(D:O) ; also sheet 1
C21: E8.6(C:O) ; also sheet 1
C22: E8.4(B:O) ; also sheet 1
C23: E8.2(A:O) ; also sheet 1
C24: E8.12(F:O) ; also sheet 1
C25: E8.10(E:O) ; also sheet 1
C26: E8.8(D:O) ; also sheet 1
C27: E3.6(C:O) ; also sheet 1
C28: E3.4(B:O) ; also sheet 1
C29: E3.2(A:O) ; also sheet 1
C30: E3.12(F:O) ; also sheet 1
C31: E3.10(E:O) ; also sheet 1
C32: E3.8(D:O) ; also sheet 1
D4: E22.2(A:I0) ; also sheet 3
DATA_ENAB: E22.3(A:I1) E30.9(B:Q) ; also sheet 1,3
FIELD2DATA: E21.2(A:I0) E21.9(C:I1) E29.3(A:I1) E29.6(B:I1) E29.9(C:I1) E29.12(D:I1) E33.4(B:O)
FIELD_EN: E21.5(B:I0) E30.5(A:Q) E33.2(A:I0) E36.12(D:I0)
GND [supply]: F0.1 F1.1 F2.1 S0.1 S1.1 S2.1 S3.1 S4.1 S5.1 S6.1 S7.1 S8.1 S9.1 S10.1 S11.1 ; also sheet 1,3
LAST_WORD: E3.9(D:I) E6.13(QH) ; also sheet 3
LOAD_PULSE: E36.1(A:I0) E36.2(A:I1) E36.13(D:I1) R28.1 R29.1 ; also sheet 3
N$2: E7.1(A0) R7.1 S3.2
N$3: E21.8(C:I0) E29.5(B:I0) F2.2 R1.1
N$4: E21.3(A:I1) E29.8(C:I0) F1.2 R2.1
N$5: E29.2(A:I0) E29.11(D:I0) F0.2 R3.1
N$6: E7.6(A1) R6.1 S2.2
N$7: E7.10(A2) R5.1 S0.2
N$8: E7.15(A3) R4.1 S1.2
N$9: E7.14(B3) I1.2 R8.2
N$10: E7.11(B2) I0.2 R9.2
N$11: E7.5(B1) I2.2 R10.2
N$12: E7.2(B0) I3.2 R11.2
N$14: E11.1(A0) R15.1 S5.2
N$15: E11.6(A1) R14.1 S4.2
N$16: E11.10(A2) R13.1 S6.2
N$17: E11.15(A3) R12.1 S7.2
N$18: E11.14(B3) I7.2 R16.2
N$19: E11.11(B2) I6.2 R17.2
N$20: E11.5(B1) I4.2 R18.2
N$21: E11.2(B0) I5.2 R19.2
N$23: E26.1(A0) R23.1 S9.2
N$24: E26.6(A1) R22.1 S8.2
N$25: E26.10(A2) R21.1 S10.2
N$26: E26.15(A3) R20.1 S11.2
N$27: E26.14(B3) I11.2 R24.2
N$28: E26.11(B2) I10.2 R25.2
N$29: E26.5(B1) I8.2 R26.2
N$30: E26.2(B0) I9.2 R27.2
N$31: Q1.3(C) R30.1
N$32: E31.3(QA) E34.5(C:I)
N$57: Q1.2(B) R29.2
N$58: E30.11(B:CLK) E36.11(D:O)
N$59: E30.3(A:CLK) E36.3(A:O)
N$63: E15.13(D:O) E21.6(B:I1) E22.5(B:I0) E36.5(B:I1)
N$69: E31.6(QD) E34.13(F:I)
N$70: E9.5(QC) E10.11(E:I)
N$71: E9.6(QD) E10.9(D:I)
N$72: E3.3(B:I) E6.6(QD)
N$73: E31.4(QB) E34.3(B:I)
N$74: E31.5(QC) E34.1(A:I)
N$75: E31.10(QE) E34.11(E:I)
N$76: E31.11(QF) E34.9(D:I)
N$77: E28.5(C:I) E31.12(QG)
N$78: E25.3(QA) E28.1(A:I)
N$79: E25.4(QB) E28.13(F:I)
N$80: E25.5(QC) E28.11(E:I)
N$81: E25.6(QD) E28.9(D:I)
N$82: E24.1(A:I) E25.10(QE)
N$83: E9.3(QA) E10.1(A:I)
N$84: E6.3(QA) E8.11(E:I)
N$85: E3.11(E:I) E6.12(QG)
N$86: E3.13(F:I) E6.11(QF)
N$87: E3.1(A:I) E6.10(QE)
N$88: E24.13(F:I) E25.11(QF)
N$89: E24.11(E:I) E25.12(QG)
N$90: E9.4(QB) E10.13(F:I)
N$91: E8.5(C:I) E9.10(QE)
N$92: E8.3(B:I) E9.11(QF)
N$93: E8.1(A:I) E9.12(QG)
N$94: E6.4(QB) E8.9(D:I)
N$95: E3.5(C:I) E6.5(QC)
N$96: E6.1(A) E6.2(B) E8.13(F:I) E9.13(QH)
N$97: E9.1(A) E9.2(B) E24.9(D:I) E25.13(QH)
N$98: E25.1(A) E25.2(B) E28.3(B:I) E31.13(QH)
N$116: E33.3(A:I1) E33.5(B:I0) E36.6(B:O)
N$141: E15.11(D:I0) E20.14(C:O)
PULSE_LA: Q1.1(E) ; also sheet 1
SHIFT_CLOCK: E6.8(CLK) E9.8(CLK) E25.8(CLK) E31.8(CLK) ; also sheet 3
TS1: E27.3(A:O) E31.1(A) E31.2(B)
VCC [supply]: R1.2 R2.2 R3.2 R4.2 R5.2 R6.2 R7.2 R12.2 R13.2 R14.2 R15.2 R20.2 R21.2 R22.2 R23.2 R28.2 R30.2 ; also sheet 1,3
Unconnected: E21.11(D:I0) E21.12(D:I1) E21.13(D:O)

### Notes on the sheet
- FIELD | DATA

## Sheet 3 of 3
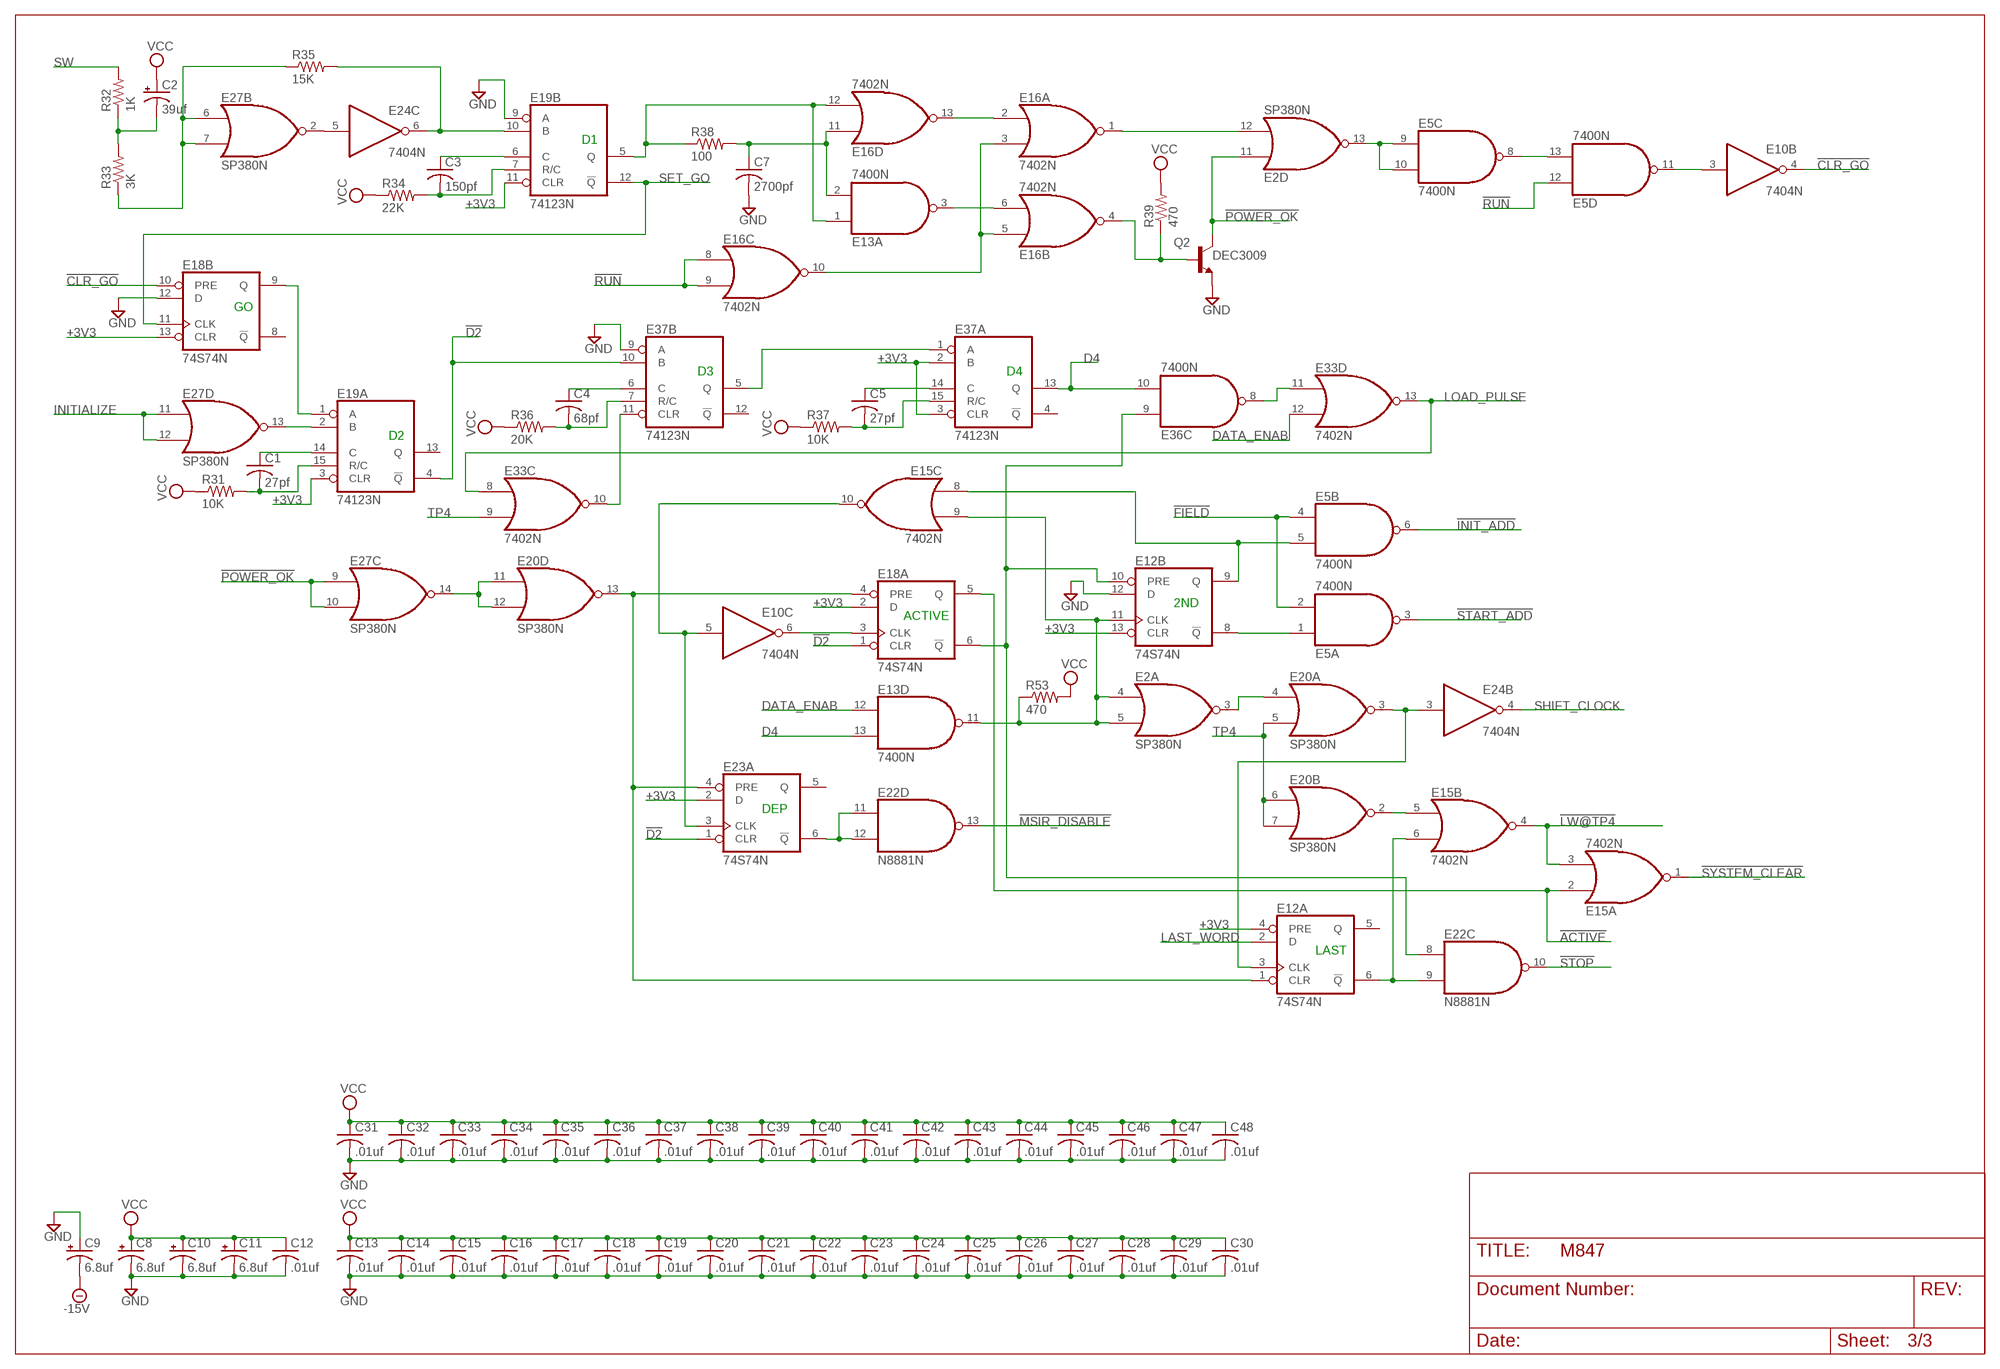
[diagram p2: schematic, sheet 3]

### Parts
C1  27pf  C-US050-025X075  [C050-025X075]
C2  39uf  CPOL-USE15-5AXIAL  [E15-5]
C3  150pf  C-US050-025X075  [C050-025X075]
C4  68pf  C-US050-025X075  [C050-025X075]
C5  27pf  C-US050-025X075  [C050-025X075]
C7  2700pf  C-US102-043X133  [C102-043X133]
C8  6.8uf  CPOL-USE15-5AXIAL  [E15-5]
C9  6.8uf  CPOL-USE15-5AXIAL  [E15-5]
C10  6.8uf  CPOL-USE15-5AXIAL  [E15-5]
C11  6.8uf  CPOL-USE15-5AXIAL  [E15-5]
C12  .01uf  C-US050-025X075  [C050-025X075]
C13  .01uf  C-US050-025X075  [C050-025X075]
C14  .01uf  C-US050-025X075  [C050-025X075]
C15  .01uf  C-US050-025X075  [C050-025X075]
C16  .01uf  C-US050-025X075  [C050-025X075]
C17  .01uf  C-US050-025X075  [C050-025X075]
C18  .01uf  C-US050-025X075  [C050-025X075]
C19  .01uf  C-US050-025X075  [C050-025X075]
C20  .01uf  C-US050-025X075  [C050-025X075]
C21  .01uf  C-US050-025X075  [C050-025X075]
C22  .01uf  C-US050-025X075  [C050-025X075]
C23  .01uf  C-US050-025X075  [C050-025X075]
C24  .01uf  C-US050-025X075  [C050-025X075]
C25  .01uf  C-US050-025X075  [C050-025X075]
C26  .01uf  C-US050-025X075  [C050-025X075]
C27  .01uf  C-US050-025X075  [C050-025X075]
C28  .01uf  C-US050-025X075  [C050-025X075]
C29  .01uf  C-US050-025X075  [C050-025X075]
C30  .01uf  C-US050-025X075  [C050-025X075]
C31  .01uf  C-US050-025X075  [C050-025X075]
C32  .01uf  C-US050-025X075  [C050-025X075]
C33  .01uf  C-US050-025X075  [C050-025X075]
C34  .01uf  C-US050-025X075  [C050-025X075]
C35  .01uf  C-US050-025X075  [C050-025X075]
C36  .01uf  C-US050-025X075  [C050-025X075]
C37  .01uf  C-US050-025X075  [C050-025X075]
C38  .01uf  C-US050-025X075  [C050-025X075]
C39  .01uf  C-US050-025X075  [C050-025X075]
C40  .01uf  C-US050-025X075  [C050-025X075]
C41  .01uf  C-US050-025X075  [C050-025X075]
C42  .01uf  C-US050-025X075  [C050-025X075]
C43  .01uf  C-US050-025X075  [C050-025X075]
C44  .01uf  C-US050-025X075  [C050-025X075]
C45  .01uf  C-US050-025X075  [C050-025X075]
C46  .01uf  C-US050-025X075  [C050-025X075]
C47  .01uf  C-US050-025X075  [C050-025X075]
C48  .01uf  C-US050-025X075  [C050-025X075]
E2  SP380N  [DIL14]
E5  7400N  [DIL14]
E12  74S74N  [DIL14]
E13  7400N  [DIL14]
E16  7402N  [DIL14]
E18  74S74N  [DIL14]
E19  74123N  [DIL16]
E23  74S74N  [DIL14]
E37  74123N  [DIL16]
Q2  DEC3009  -NPN-TO92  [TO92]
R31  10K  R-US_0207/10  [0207/10]
R32  1K  R-US_0207/10  [0207/10]
R33  3K  R-US_0207/10  [0207/10]
R34  22K  R-US_0207/10  [0207/10]
R35  15K  R-US_0207/10  [0207/10]
R36  20K  R-US_0207/10  [0207/10]
R37  10K  R-US_0207/10  [0207/10]
R38  100  R-US_0207/10  [0207/10]
R39  470  R-US_0207/10  [0207/10]
R53  470  R-US_0207/10  [0207/10]

### Nets
!ACTIVE: E15.2(A:I0) E18.5(A:Q) ; also sheet 2
!CLR_D3: E33.10(C:O) E37.11(B:CLR)
!CLR_GO: E10.4(B:O) E18.10(B:PRE)
!D2: E18.1(A:CLR) E19.4(A:!Q) E23.1(A:CLR) E37.10(B:B)
!DEP: E22.11(D:I0) E22.12(D:I1) E23.6(A:!Q)
!FIELD: E5.2(A:I1) E5.4(B:I0) ; also sheet 2
!GO: E18.9(B:Q) E19.1(A:A)
!INIT_ADD: E5.6(B:O) ; also sheet 1,2
!LAST: E12.6(A:!Q) E15.6(B:I1) E22.9(C:I1)
!LW@TP4: E15.3(A:I1) E15.4(B:O)
!MSIR_DISABLE: E22.13(D:O) ; also sheet 1
!POWER_OK: E2.11(D:I0) E27.9(C:I0) E27.10(C:I1) Q2.3(C) ; also sheet 1
!RUN: E5.12(D:I0) E16.8(C:I0) E16.9(C:I1) ; also sheet 1
!START_ADD: E5.3(A:O) ; also sheet 1,2
!STOP: E22.10(C:O) ; also sheet 1
!SYSTEM_CLEAR: E15.1(A:O) ; also sheet 2
+3V3 [supply]: E12.4(A:PRE) E12.13(B:CLR) E18.2(A:D) E18.13(B:CLR) E19.3(A:CLR) E19.11(B:CLR) E23.2(A:D) E37.2(A:B) E37.3(A:CLR) ; also sheet 1,2
-15V [supply]: C9.- ; also sheet 1,2
ACTIVE: E12.10(B:PRE) E18.6(A:!Q) E22.8(C:I0) E36.9(C:I0)
D1_DELAYED: C7.1 E13.2(A:I1) E16.11(D:I0) R38.2
D4: E13.13(D:I1) E36.10(C:I1) E37.13(A:Q) ; also sheet 2
DATA_ENAB: E13.12(D:I0) E33.12(D:I1) ; also sheet 1,2
GND [supply]: C7.2 C8.- C9.+ C10.- C11.- C12.2 C13.2 C14.2 C15.2 C16.2 C17.2 C18.2 C19.2 C20.2 C21.2 C22.2 C23.2 C24.2 C25.2 C26.2 C27.2 C28.2 C29.2 C30.2 C31.2 C32.2 C33.2 C34.2 C35.2 C36.2 C37.2 C38.2 C39.2 C40.2 C41.2 C42.2 C43.2 C44.2 C45.2 C46.2 C47.2 C48.2 E12.12(B:D) E18.12(B:D) E19.9(B:A) E37.9(B:A) Q2.1(E) ; also sheet 1,2
INITIALIZE: E27.11(D:I0) E27.12(D:I1) ; also sheet 1
LAST_WORD: E12.2(A:D) ; also sheet 2
LOAD_PULSE: E33.8(C:I0) E33.13(D:O) ; also sheet 2
N$60: E19.2(A:B) E27.13(D:O)
N$61: E10.6(C:O) E18.3(A:CLK)
N$65: C1.1 E19.14(A:C)
N$112: C1.2 E19.15(A:R/C) R31.2
N$113: C3.1 E19.6(B:C)
N$114: C2.- R32.1 R33.2
N$115: E27.6(B:I0) E27.7(B:I1) R33.1 R35.1
N$117: E24.5(C:I) E27.2(B:O)
N$118: E19.10(B:B) E24.6(C:O) R35.2
N$119: C3.2 E19.7(B:R/C) R34.2
N$121: C4.2 E37.7(B:R/C) R36.2
N$122: C4.1 E37.6(B:C)
N$123: C5.1 E37.14(A:C)
N$124: C5.2 E37.15(A:R/C) R37.2
N$125: E37.1(A:A) E37.5(B:Q)
N$126: E13.1(A:I0) E16.12(D:I1) E19.5(B:Q) R38.1
N$128: E16.2(A:I0) E16.13(D:O)
N$130: E13.3(A:O) E16.6(B:I1)
N$131: E2.12(D:I1) E16.1(A:O)
N$132: E2.13(D:O) E5.9(C:I0) E5.10(C:I1)
N$133: E16.4(B:O) Q2.2(B) R39.1
N$134: E5.8(C:O) E5.13(D:I1)
N$136: E5.11(D:O) E10.3(B:I)
N$137: E33.11(D:I0) E36.8(C:O)
N$139: E12.1(A:CLR) E18.4(A:PRE) E20.13(D:O) E23.4(A:PRE)
N$140: E20.11(D:I0) E20.12(D:I1) E27.14(C:O)
N$143: E2.4(A:I0) E2.5(A:I1) E12.11(B:CLK) E13.11(D:O) E15.9(C:I1) R53.1
N$145: E12.3(A:CLK) E20.3(A:O) E24.3(B:I)
N$147: E5.5(B:I1) E12.9(B:Q) E15.8(C:I0)
N$148: E5.1(A:I0) E12.8(B:!Q)
N$149: E15.5(B:I0) E20.2(B:O)
N$151: E2.3(A:O) E20.4(A:I0)
N$152: E10.5(C:I) E15.10(C:O) E23.3(A:CLK)
RUN: E16.3(A:I1) E16.5(B:I0) E16.10(C:O)
SET_GO: E18.11(B:CLK) E19.12(B:!Q)
SHIFT_CLOCK: E24.4(B:O) ; also sheet 2
SW: R32.2 ; also sheet 1
TP4: E20.5(A:I1) E20.6(B:I0) E20.7(B:I1) E33.9(C:I1) ; also sheet 1
VCC [supply]: C2.+ C8.+ C10.+ C11.+ C12.1 C13.1 C14.1 C15.1 C16.1 C17.1 C18.1 C19.1 C20.1 C21.1 C22.1 C23.1 C24.1 C25.1 C26.1 C27.1 C28.1 C29.1 C30.1 C31.1 C32.1 C33.1 C34.1 C35.1 C36.1 C37.1 C38.1 C39.1 C40.1 C41.1 C42.1 C43.1 C44.1 C45.1 C46.1 C47.1 C48.1 R31.1 R34.1 R36.1 R37.1 R39.2 R53.2 ; also sheet 1,2
Unconnected: E2.2(B:O) E2.6(B:I0) E2.7(B:I1) E2.9(C:I0) E2.10(C:I1) E2.14(C:O) E12.5(A:Q) E13.4(B:I0) E13.5(B:I1) E13.6(B:O) E13.8(C:O) E13.9(C:I0) E13.10(C:I1) E18.8(B:!Q) E19.13(A:Q) E23.5(A:Q) E23.8(B:!Q) E23.9(B:Q) E23.10(B:PRE) E23.11(B:CLK) E23.12(B:D) E23.13(B:CLR) E37.4(A:!Q) E37.12(B:!Q)

### Notes on the sheet
- D1
- GO
- D3 | D4
- D2
- 2ND
- ACTIVE
- DEP
- LAST

## Power pins joined to a net without a drawn wire
GND: E1.1(GND) E2.1(P:GND) E3.7(P:GND) E4.7(P:GND) E5.7(P:GND) E6.7(GND) E7.8(GND) E8.7(P:GND) E9.7(GND) E10.7(P:GND) E11.8(GND) E12.7(P:GND) E13.7(P:GND) E14.7(P:GND) E15.7(P:GND) E16.7(P:GND) E17.1(GND) E18.7(P:GND) E19.8(P:GND) E20.1(P:GND) E21.7(P:GND) E22.7(P:GND) E23.7(P:GND) E24.7(P:GND) E25.7(GND) E26.8(GND) E27.1(P:GND) E28.7(P:GND) E29.7(P:GND) E30.7(P:GND) E31.7(GND) E32.7(P:GND) E33.7(P:GND) E34.7(P:GND) E35.1(GND) E36.7(P:GND) E37.8(P:GND)
VCC: E1.8(VCC) E2.8(P:VCC) E3.14(P:VCC) E4.14(P:VCC) E5.14(P:VCC) E6.14(VCC) E7.16(VCC) E8.14(P:VCC) E9.14(VCC) E10.14(P:VCC) E11.16(VCC) E12.14(P:VCC) E13.14(P:VCC) E14.14(P:VCC) E15.14(P:VCC) E16.14(P:VCC) E17.8(VCC) E18.14(P:VCC) E19.16(P:VCC) E20.8(P:VCC) E21.14(P:VCC) E22.14(P:VCC) E23.14(P:VCC) E24.14(P:VCC) E25.14(VCC) E26.16(VCC) E27.8(P:VCC) E28.14(P:VCC) E29.14(P:VCC) E30.14(P:VCC) E31.14(VCC) E32.14(P:VCC) E33.14(P:VCC) E34.14(P:VCC) E35.8(VCC) E36.14(P:VCC) E37.16(P:VCC)

## Library data of the parts
C1 C3-C7 C12-C48 = rcl:C-US: CAPACITOR, American symbol
C2 C8-C11 = rcl:CPOL-US: POLARIZED CAPACITOR, American symbol
D1-D386 = diode:1N4148: DIODE high speed (Philips)
E1 E17 E35 = dec-con:SP384: Quad OR gate
E2 E20 E27 = dec-con:SP380: Quad NOR gate (use 8640)
E3 E8 E10 E24 E28 E34 = 74xx-us:74*04: Hex INVERTER
E4 E14 E21 E22 E29 E32 = dec-con:N8881: Quad 2-input NAND gate, open collector
E5 E13 E36 = 74xx-us:74*00: Quad 2-input NAND gate
E6 E9 E25 E31 = 74xx-us:74*164: 8-bit parallel out SHIFT REGISTER
E7 E11 E26 = dec-con:DEC8235: 4-bit data selector
E12 E18 E23 E30 = 74xx-us:74*74: Dual D type positive edge triggered FLIP FLOP, preset and clear
E15 E16 E33 = 74xx-us:74*02: Quad 2-input NOR gate
E19 E37 = 74xx-us:74*123: Retriggerable monostable MULTIVIBRATOR
F0 F1 F2 I0 I1-I11 S0 S1-S11 = jumper:J: Bridge
Q1 Q2 = transistor:*-NPN-: NPN Transistror BF959 corrected 2008.03.06
R1-R53 = rcl:R-US_: RESISTOR, American symbol
U$1 = dec-con:OUTLINE-*: Board outlines for DEC boards.
U$2 = dec-con:QUAD: Quad-Height DEC board

## Net classes
1 supply: width 0.635 mm